# Altium schematic sheet HC-06.SchDoc
size Legal; SheetNumber: 8; SheetTotal: 8
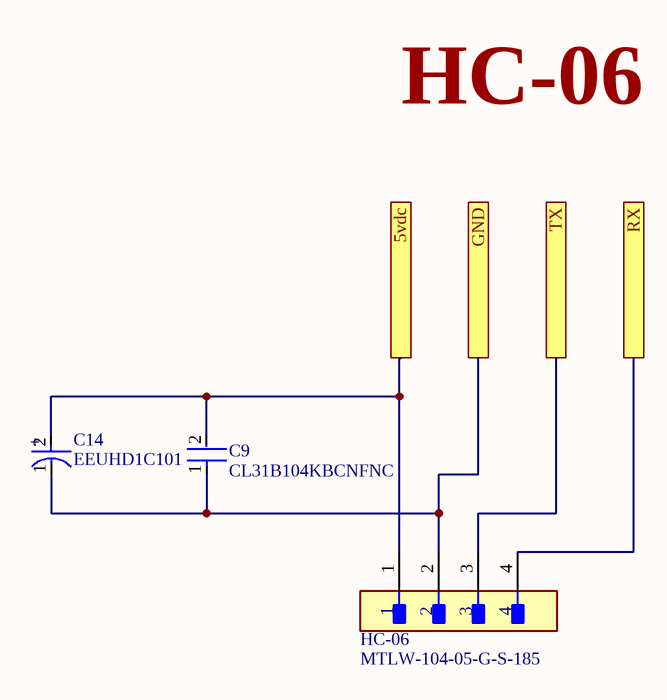
[diagram p0: HC-06.SchDoc]

## Parts
C9  CL31B104KBCNFNC  [FP-CL31-IPC_C]
C14  EEUHD1C101  [FP-RAD-TH-D_5_0_5-L_11_1-MFG]
HC-06  MTLW-104-05-G-S-185  [FP-MTLW-104-05-G-S-185-MFG]

## Ports
5vdc, GND, RX, TX

## Nets
5vdc: C9.2 C14.2(A) HC-06.1 ; port 5vdc
GND: C9.1 C14.1(C) HC-06.2 ; port GND
RX: HC-06.4 ; port RX
TX: HC-06.3 ; port TX

## Notes on the sheet
- HC-06
- (in symbol CMP-05427-000949-1) +

## Library data of the parts
C9 = CMP-13271-001276-1: Cap Ceramic 100nF 50V X7R ±10% SMD 1206 +125°C Embossed T/R; Dielectric: X7R; Case Code (Metric): 3216; Package Quantity: 1; Thickness: 0.037inch; Depth: 1.6mm; Packaging: Tape and Reel; Capacitance: 100nF; Length: 0.126inch; Tolerance: 10%; Voltage Rating: 50V; Case Code (Imperial): 1206; Radiation Hardening: No; Width: 0.063inch; Case/Package: 1206; Max Operating Temperature: 125°C; Min Operating Temperature: -55°C; Height: 0.85mm; Mount: Surface Mount
C14 = CMP-05427-000949-1: Aluminum Electrolytic Capacitors (Radial Lead Type) AEC-Q200 Qualified 100uF ±20% 16V; Lead/Base Style: Straight; Life (Hours): 1000Hour; Polarity: Polar; Ripple Current: 110mA; Lead Diameter: 0.5mm; Packaging: Bulk; Tolerance: 20%; Package Quantity: 200; Lead Pitch: 2.5mm; RoHS Compliant: Yes; Length: 11mm; Capacitance: 100uF; Max Operating Temperature: 105°C; REACH SVHC: No SVHC; Termination: Radial; Lead Free: Lead Free; Number of Pins: 2; Ripple Current (AC): 110mA; Mount: Through Hole; Diameter: 5mm; Min Operating Temperature: -55°C; Construction: RADIAL; Voltage Rating: 16V; Voltage Rating (DC): 16V; Case/Package: Radial; Height: 11mm; Height - Seated (Max): 0.492inch; Voltage: 16V; Series: HD
HC-06 = CMP-02766-000562-1: CONN HEADER VERT 4POS 2.54MM; Number of Contacts: 4; Contact Resistance: 15mR; Connector Type: Male Pin; Gender: Male; Contact Material: Brass; Height: 6.4mm; Contact Mating Length: 0.185inch; Length: 29.64mm; Number of Positions: 4; Packaging: Rail/Tube; Mount: Through Hole; Depth: 2.48mm; Number of Rows: 1; Radiation Hardening: No; Housing Material: Polymer; Pitch: 2.54mm; Max Operating Temperature: 105°C; Termination: Solder; Min Operating Temperature: -40°C; Color: Black; Orientation: Straight; Housing Color: Black; Contact Plating: Gold